# EAGLE design 90USB1286 (EAGLE 6.3)
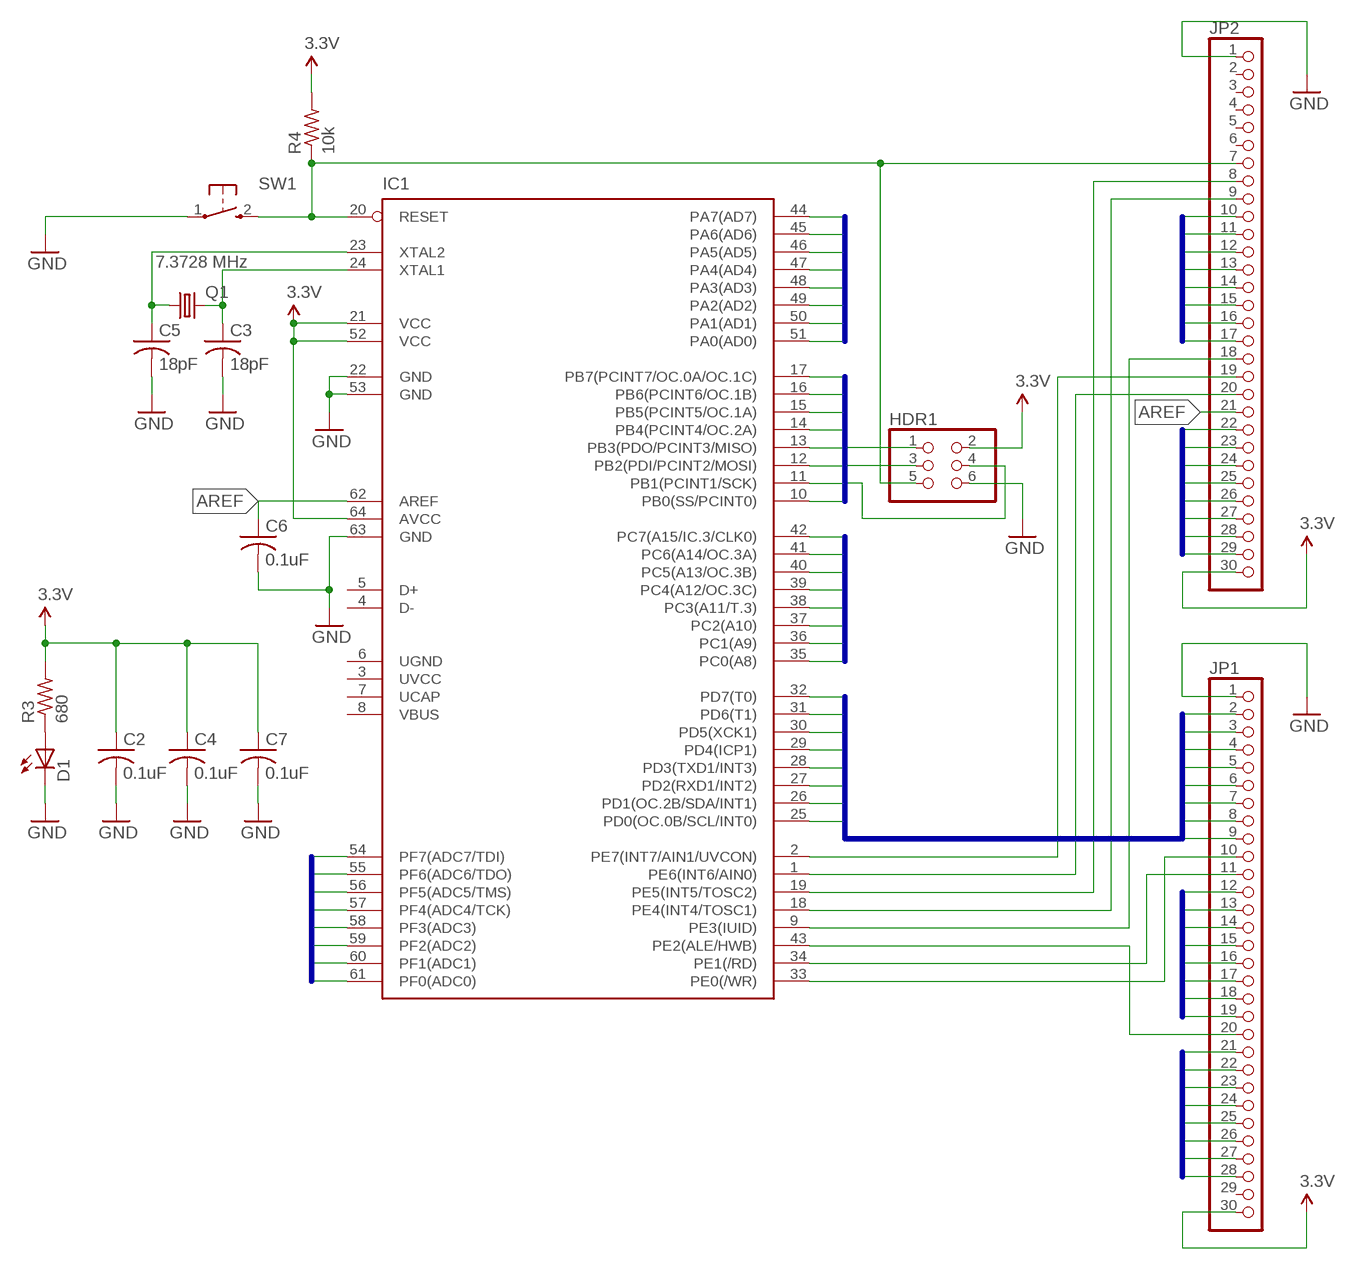
[diagram p0: schematic, sheet 1]

## Parts
C2  0.1uF  0603_CAP  [0603_RESISTOR]
C3  18pF  0603_CAP  [0603_RESISTOR]
C4  0.1uF  0603_CAP  [0603_RESISTOR]
C5  18pF  0603_CAP  [0603_RESISTOR]
C6  0.1uF  0603_CAP  [0603_RESISTOR]
C7  0.1uF  0603_CAP  [0603_RESISTOR]
D1  LEDCHIP-LED0603  [CHIP-LED0603]
HDR1  HEADER_2X3  [HEADER_2X3]
IC1  AT90USB1286MLF  [MLF64]
JP1  PINHD-1X30  [1X30]
JP2  PINHD-1X30  [1X30]
Q1  7.3728 MHz  CRYSTALCTS406  [CTS406]
R3  680  0603_RESISTOR  [0603_RESISTOR]
R4  10k  0603_RESISTOR  [0603_RESISTOR]
SW1  TAC-SWITCH  [TAC-SWITCH]

## Nets
3.3V: C2.1 C4.1 C7.1 HDR1.2 IC1.21(VCC) IC1.52(VCC) IC1.64(AVCC) JP1.30 JP2.30 R3.2 R4.2
A0: IC1.51(PA0(AD0)) JP1.28
A1: IC1.50(PA1(AD1)) JP1.27
A2: IC1.49(PA2(AD2)) JP1.26
A3: IC1.48(PA3(AD3)) JP1.25
A4: IC1.47(PA4(AD4)) JP1.24
A5: IC1.46(PA5(AD5)) JP1.23
A6: IC1.45(PA6(AD6)) JP1.22
A7: IC1.44(PA7(AD7)) JP1.21
AREF: C6.1 IC1.62(AREF) JP2.21
B0: IC1.10(PB0(SS/PCINT0)) JP2.17
B1: HDR1.3 IC1.11(PB1(PCINT1/SCK)) JP2.16
B2: HDR1.4 IC1.12(PB2(PDI/PCINT2/MOSI)) JP2.15
B3: HDR1.1 IC1.13(PB3(PDO/PCINT3/MISO)) JP2.14
B4: IC1.14(PB4(PCINT4/OC.2A)) JP2.13
B5: IC1.15(PB5(PCINT5/OC.1A)) JP2.12
B6: IC1.16(PB6(PCINT6/OC.1B)) JP2.11
B7: IC1.17(PB7(PCINT7/OC.0A/OC.1C)) JP2.10
C0: IC1.35(PC0(A8)) JP1.12
C1: IC1.36(PC1(A9)) JP1.13
C2: IC1.37(PC2(A10)) JP1.14
C3: IC1.38(PC3(A11/T.3)) JP1.15
C4: IC1.39(PC4(A12/OC.3C)) JP1.16
C5: IC1.40(PC5(A13/OC.3B)) JP1.17
C6: IC1.41(PC6(A14/OC.3A)) JP1.18
C7: IC1.42(PC7(A15/IC.3/CLK0)) JP1.19
D0: IC1.25(PD0(OC.0B/SCL/INT0)) JP1.2
D1: IC1.26(PD1(OC.2B/SDA/INT1)) JP1.3
D2: IC1.27(PD2(RXD1/INT2)) JP1.4
D3: IC1.28(PD3(TXD1/INT3)) JP1.5
D4: IC1.29(PD4(ICP1)) JP1.6
D5: IC1.30(PD5(XCK1)) JP1.7
D6: IC1.31(PD6(T1)) JP1.8
D7: IC1.32(PD7(T0)) JP1.9
E0: IC1.33(PE0(/WR)) JP1.10
E1: IC1.34(PE1(/RD)) JP1.11
E2: IC1.43(PE2(ALE/HWB)) JP1.20
E3: IC1.9(PE3(IUID)) JP2.18
E4: IC1.18(PE4(INT4/TOSC1)) JP2.9
E5: IC1.19(PE5(INT5/TOSC2)) JP2.8
E6: IC1.1(PE6(INT6/AIN0)) JP2.20
E7: IC1.2(PE7(INT7/AIN1/UVCON)) JP2.19
F0: IC1.61(PF0(ADC0)) JP2.22
F1: IC1.60(PF1(ADC1)) JP2.23
F2: IC1.59(PF2(ADC2)) JP2.24
F3: IC1.58(PF3(ADC3)) JP2.25
F4: IC1.57(PF4(ADC4/TCK)) JP2.26
F5: IC1.56(PF5(ADC5/TMS)) JP2.27
F6: IC1.55(PF6(ADC6/TDO)) JP2.28
F7: IC1.54(PF7(ADC7/TDI)) JP2.29
GND: C2.2 C3.2 C4.2 C5.2 C6.2 C7.2 D1.C HDR1.6 IC1.22(GND) IC1.53(GND) IC1.63(GND) JP1.1 JP2.1 SW1.1
N$1: C5.1 IC1.23(XTAL2) Q1.1
N$2: C3.1 IC1.24(XTAL1) Q1.3
N$3: D1.A R3.1
RESET: HDR1.5 IC1.20(RESET) JP2.7 R4.1 SW1.2
Unconnected: IC1.4(D-) IC1.5(D+) JP1.29 JP2.2 JP2.3 JP2.4 JP2.5 JP2.6

## Buses
D[0..7]
C[0..7]
A[0..7]
B[0..7]
F[0..7]

## Power pins joined to a net without a drawn wire
UCAP: IC1.7(UCAP)
UGND: IC1.6(UGND)
UVCC: IC1.3(UVCC)
VBUS: IC1.8(VBUS)

## Library data of the parts
C2-C7 = jkf-parts:0603_CAP: 0603 Capacitor
D1 = adafruit:LED: LED OSRAM: - CHIPLED LG R971, LG N971, LY N971, LG Q971, LY Q971, LO R971, LY R971 LH N974, LH R974 LS Q976, LO Q976, LY Q976 LO Q996 - Hyper CHIPLED LW Q18S LB Q993, LB Q99A, LB R99A - SideLED LS A670, LO A670, LY A670, LG A670, LP A670 LB A673, LV A673, LT A673, LW A673 LH A674 LY A675 LS A676, LA A676, LO A676, LY A676, LW A676 LS A679, LY A679, LG A679 - Hyper Micro SIDELED® LS Y876, LA Y876, LO Y876, LY Y876 LT Y87S - SmartLED LW L88C, LW L88S LB L89C, LB L89S, LG L890 LS L89K, LO L89K, LY L89K LS L896, LA L896, LO L896, LY L896 - TOPLED LS T670, LO T670, LY T670, LG T670, LP T670 LSG T670, LSP T670, LSY T670, LOP T670, LYG T670 LG T671, LOG T671, LSG T671 LB T673, LV T673, LT T673, LW T673 LH T674 LS T676, LA T676, LO T676, LY T676, LB T676, LH T676, LSB T676, LW T676 LB T67C, LV T67C, LT T67C, LS T67K, LO T67K, LY T67K, LW E67C LS E67B, LA E67B, LO E67B, LY E67B, LB E67C, LV E67C, LT E67C LW T67C LS T679, LY T679, LG T679 LS T770, LO T770, LY T770, LG T770, LP T770 LB T773, LV T773, LT T773, LW T773 LH T774 LS E675, LA E675, LY E675, LS T675 LS T776, LA T776, LO T776, LY T776, LB T776 LHGB T686 LT T68C, LB T68C - Hyper Mini TOPLED® LB M676 - Mini TOPLED Santana® LG M470 LS M47K, LO M47K, LY M47K Source: http://www.osram.convergy.de/
HDR1 = jkf:HEADER_2X3; DIGIKEY#: 609-3487-1-ND; MANF: FCI; MANF#: 95278-101A06LF
IC1 = jkf:AT90USB1286
JP1 JP2 = pinhead:PINHD-1X30: PIN HEADER
Q1 = crystal:CRYSTAL: CRYSTAL; OC_FARNELL: unknown; OC_NEWARK: unknown
R3 R4 = jkf-parts:0603_RESISTOR
SW1 = jkf-parts:TAC-SWITCH

## Board
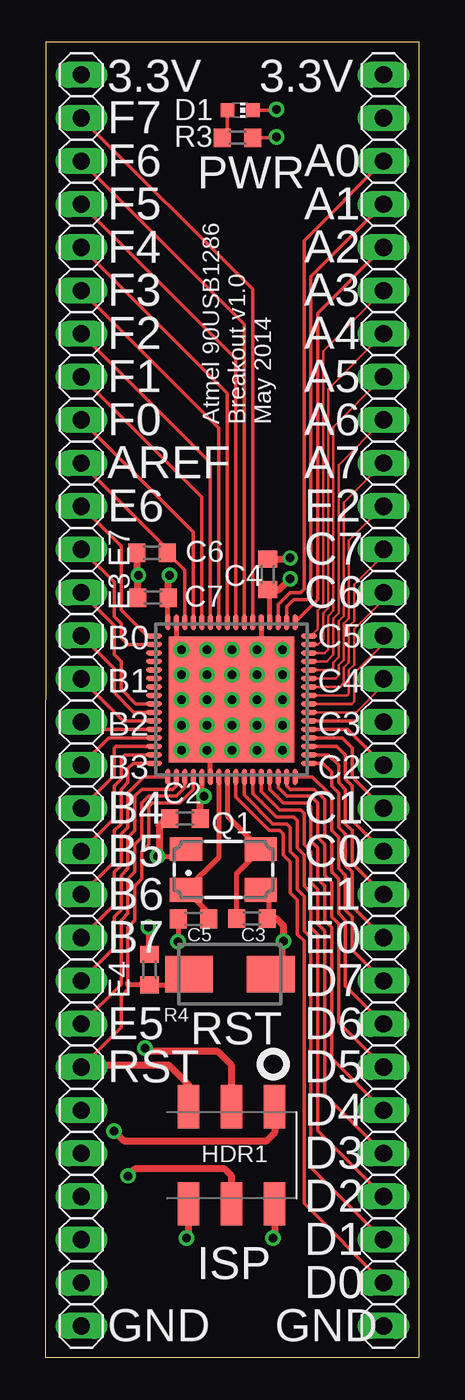
[diagram p1: board, top side]
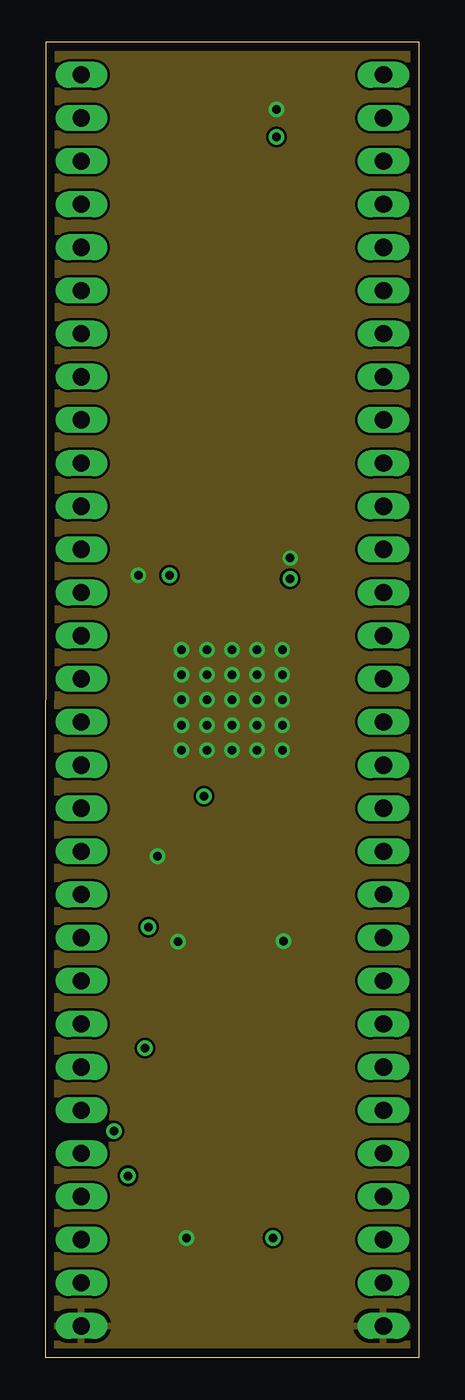
[diagram p2: board, inner layer GND]
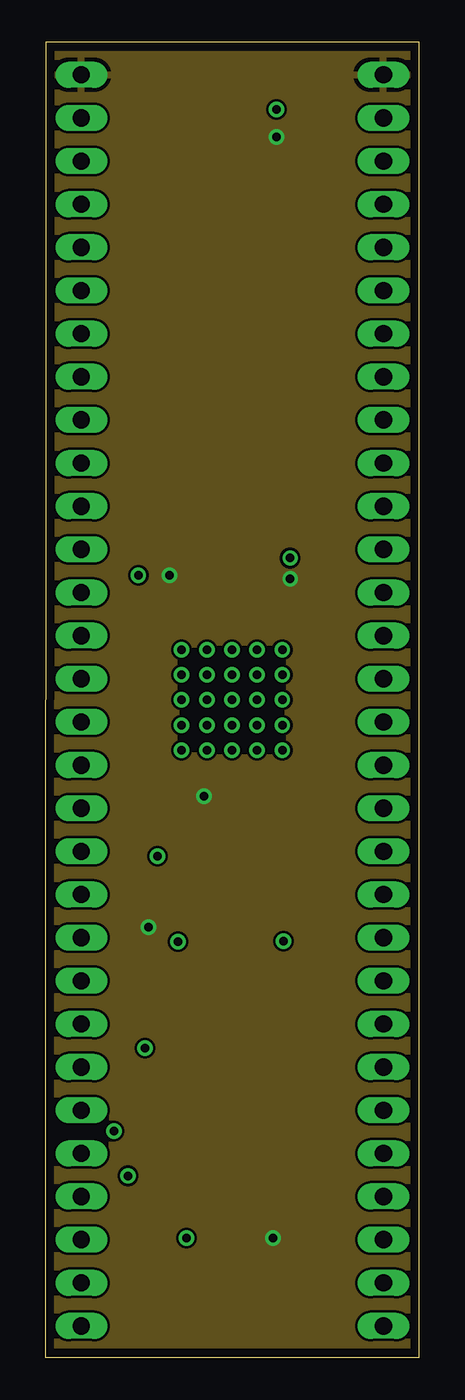
[diagram p3: board, inner layer 3.3V]
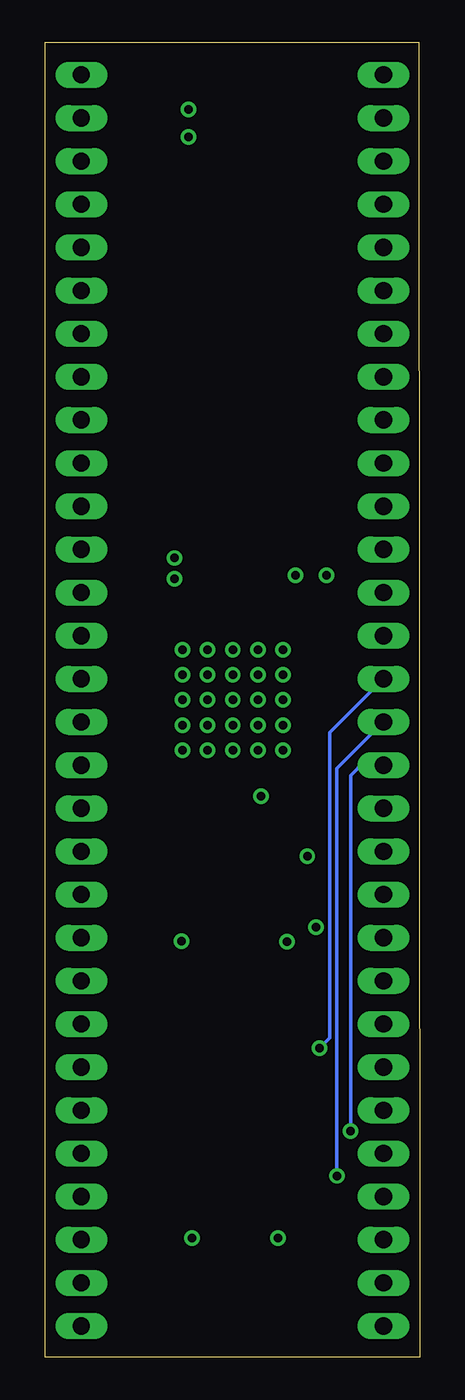
[diagram p4: board, bottom side, seen from below]

Size 22.03 x 77.39 mm. Coordinates in mm from the lower left corner, seen from the top.
Outline: 0,0 22.03,0 22.03,77.39 0.05,77.39 0,0
Copper layers (1+2*15+16): Top 0.0178mm / dielectric 12mil / GND 0.0356mm / dielectric 28mil / 3.3V 0.0356mm / dielectric 12mil / Bottom 0.0178mm
Design rules "SSC-EAGLE-4Lyr_v1.0.0.3": minimum track width 6mil, minimum drill 8mil, track to track 6mil, track to pad 6mil, pad to pad 6mil, via to via 6mil, smd to smd 6mil, copper to edge 20mil, drill to drill 16mil, minimum pad ring 8mil, minimum via ring 8mil, stop-mask expansion 3mil, vias tented up to drill 0mil, thermal gap 10mil

### Footprints (pad centres in the part's own frame; a part is rotated, then mirrored left to right if it is on the bottom)
0603_RESISTOR = smd 1 x 1.1: 1 -0.9,0; 2 0.9,0
CHIP-LED0603 = smd 0.8 x 0.8: A 0,-0.75; C 0,0.75
HEADER_2X3 = smd 1.27 x 2.54: 1 -2.54,-2.853; 2 -2.54,2.862; 3 0,-2.853; 4 0,2.862; 5 2.54,-2.853; 6 2.54,2.862
MLF64 = smd 0.95 x 0.3: 1 -4.56,3.75; 2 -4.56,3.25; 3 -4.56,2.75; 4 -4.56,2.25; 5 -4.56,1.75; 6 -4.56,1.25; 7 -4.56,0.75; 8 -4.56,0.25; 9 -4.56,-0.25; 10 -4.56,-0.75; 11 -4.56,-1.25; 12 -4.56,-1.75; 13 -4.56,-2.25; 14 -4.56,-2.75; 15 -4.56,-3.25; 16 -4.56,-3.75; 33 4.56,-3.75; 34 4.56,-3.25; 35 4.56,-2.75; 36 4.56,-2.25; 37 4.56,-1.75; 38 4.56,-1.25; 39 4.56,-0.75; 40 4.56,-0.25; 41 4.56,0.25; 42 4.56,0.75; 43 4.56,1.25; 44 4.56,1.75; 45 4.56,2.25; 46 4.56,2.75; 47 4.56,3.25; 48 4.56,3.75 | smd 0.3 x 0.95: 17 -3.75,-4.56; 18 -3.25,-4.56; 19 -2.75,-4.56; 20 -2.25,-4.56; 21 -1.75,-4.56; 22 -1.25,-4.56; 23 -0.75,-4.56; 24 -0.25,-4.56; 25 0.25,-4.56; 26 0.75,-4.56; 27 1.25,-4.56; 28 1.75,-4.56; 29 2.25,-4.56; 30 2.75,-4.56; 31 3.25,-4.56; 32 3.75,-4.56; 49 3.75,4.56; 50 3.25,4.56; 51 2.75,4.56; 52 2.25,4.56; 53 1.75,4.56; 54 1.25,4.56; 55 0.75,4.56; 56 0.25,4.56; 57 -0.25,4.56; 58 -0.75,4.56; 59 -1.25,4.56; 60 -1.75,4.56; 61 -2.25,4.56; 62 -2.75,4.56; 63 -3.25,4.56; 64 -3.75,4.56 | smd 7.4 x 7.4: P$1 0,0
1X30 = drill 1.016 long: 1 -36.83,0; 2 -34.29,0; 3 -31.75,0; 4 -29.21,0; 5 -26.67,0; 6 -24.13,0; 7 -21.59,0; 8 -19.05,0; 9 -16.51,0; 10 -13.97,0; 11 -11.43,0; 12 -8.89,0; 13 -6.35,0; 14 -3.81,0; 15 -1.27,0; 16 1.27,0; 17 3.81,0; 18 6.35,0; 19 8.89,0; 20 11.43,0; 21 13.97,0; 22 16.51,0; 23 19.05,0; 24 21.59,0; 25 24.13,0; 26 26.67,0; 27 29.21,0; 28 31.75,0; 29 34.29,0; 30 36.83,0
CTS406 = smd 1.9 x 1.4: 1 -2.2,-1.2; 2 2.2,-1.2; 3 2.2,1.2; 4 -2.2,1.2
TAC-SWITCH = smd 2.8 x 2.16: 1 1.4,1.08; 2 6.2,1.08

### Placement (x,y rotation side)
C2  8.23,31.7 180 top
C3  12.17,25.81 0 top
C4  13.11,46.08 90 top
C5  8.73,25.8 180 top
C6  6.3,47.35 180 top
C7  6.35,44.7 180 top
D1  11.48,73.41 270 top
HDR1  10.97,11.89 180 top
IC1  10.97,38.71 0 top
JP1  19.91,38.66 90 top
JP2  2.13,38.66 90 top
Q1  10.49,28.69 0 top
R3  11.33,71.78 0 top
R4  6.15,22.81 90 top
SW1  14.68,23.62 180 top

### Tracks (layer width: path | path; a pad name or v marks a point on that pad's centre or on a via)
3.3V  (via drill 0.5)
  Top 0.203: R3.2 13.56,71.78 v13.61,71.83
  Top 0.305: IC1.52 13.22,45.06 C4.1 | IC1.21 9.22,33.14 v9.35,33.02 | IC1.64 7.22,44.68 C7.1 | R4.2 6.1,23.71 v6.1,25.3
  Top 0.406: C7.1 7.25,45.96 v7.32,46.02 | C4.1 13.78,45.18 v14.43,45.82 | C2.1 9.13,32.8 v9.35,33.02 | HDR1.2 13.51,7.11 v13.41,7.01
  pour 3.3V: -0.41,77.77 23.27,77.77 23.27,-0.71 -0.41,-0.71
A0
  Top 0.203: IC1.51 13.72,44.3 14.43,45.01 15.04,45.01 15.24,45.21 15.24,65.73 JP1.28
A1
  Top 0.203: IC1.50 14.22,44.2 14.63,44.6 15.44,44.6 15.65,44.81 15.65,63.6 JP1.27
A2
  Top 0.203: IC1.49 16.05,44.6 16.05,61.47 JP1.26
A3
  Top 0.152: IC1.48 15.64,42.46 16.05,42.88 16.05,43.94 16.36,44.25 16.36,59.23 JP1.25
A4
  Top 0.152: IC1.47 16.05,41.96 16.36,42.27 16.36,43.79 16.66,44.09 16.66,57 JP1.24
A5
  Top 0.152: IC1.46 16.47,41.46 16.66,41.66 16.66,43.64 16.97,43.94 16.97,54.76 JP1.23
A6
  Top 0.152: IC1.45 16.58,40.96 16.97,41.35 16.97,43.48 17.27,43.79 17.27,52.53 JP1.22
A7
  Top 0.152: IC1.44 16.84,40.46 16.97,40.59 16.97,40.89 17.27,41.2 17.27,43.33 17.58,43.64 17.58,50.29 JP1.21
AREF
  Top 0.203: IC1.62 8.22,46.32 C6.1 7.2,47.56 JP2.21
B0
  Top 0.203: IC1.10 5.22,37.96 4.06,39.12 4.06,40.54 JP2.17
B1  (via drill 0.5)
  Top 0.203: IC1.11 4.6,37.46 JP2.16
  Top 0.406: HDR1.3 10.97,17.17 10.16,17.98 6.1,17.98 v5.89,18.19
  Bottom 0.203: v5.89,18.19 5.28,18.8 5.28,36.78 JP2.16
B2  (via drill 0.5)
  Top 0.203: IC1.12 2.56,36.96 JP2.15
  Top 0.406: HDR1.4 10.97,10.67 10.57,11.07 5.28,11.07 v4.88,10.67
  Bottom 0.203: JP2.15 4.88,34.65 v4.88,10.67
B3  (via drill 0.5)
  Top 0.203: IC1.13 3.74,36.46 JP2.14
  Top 0.406: HDR1.1 13.51,13.21 13.01,12.7 4.67,12.7 v4.06,13.31
  Bottom 0.203: JP2.14 2.34,35.05 3.25,35.05 4.06,34.24 v4.06,13.31
B4
  Top 0.203: IC1.14 4.16,35.96 4.06,35.87 4.06,34.24 JP2.13
B5
  Top 0.203: IC1.15 4.67,35.46 4.47,35.26 4.47,34.04 4.06,33.63 4.06,31.7 JP2.12
B6
  Top 0.203: IC1.16 5.19,34.96 4.88,34.65 4.88,33.83 4.47,33.43 4.47,31.39 4.06,30.99 4.06,29.16 JP2.11
B7
  Top 0.203: IC1.17 5.8,34.15 4.88,33.22 4.88,31.19 4.47,30.79 4.47,28.96 4.06,28.55 4.06,26.62 JP2.10
C0
  Top 0.203: IC1.35 17.18,35.96 17.68,35.46 17.68,34.04 18.09,33.63 18.09,31.6 JP1.12
C1
  Top 0.203: IC1.36 17.49,36.46 18.09,35.87 18.09,34.14 JP1.13
C2
  Top 0.203: IC1.37 17.8,36.96 JP1.14
C3
  Top 0.203: IC1.38 19.84,37.46 JP1.15
C4
  Top 0.152: IC1.39 18.3,37.96 19.71,39.37 19.71,39.73 JP1.16
C5
  Top 0.152: IC1.40 18.04,38.46 18.19,38.61 18.19,40.28 19.86,41.96 19.86,42.42 JP1.17
C6
  Top 0.152: IC1.41 17.78,38.96 17.88,39.06 17.88,40.44 18.19,40.74 18.19,42.88 19.86,44.55 19.86,44.96 JP1.18
C7
  Top 0.152: IC1.42 17.36,39.46 17.58,39.67 17.58,40.59 17.88,40.89 17.88,43.03 18.19,43.33 18.19,45.47 19.71,46.99 19.71,47.35 JP1.19
D0
  Top 0.203: IC1.25 11.22,32.97 13.21,30.99 13.82,30.99 14.02,30.79 14.02,29.57 14.43,29.16 14.43,27.33 14.83,26.92 14.83,24.89 15.24,24.49 15.24,9.04 JP1.2
D1
  Top 0.203: IC1.26 11.72,33.08 13.41,31.39 14.22,31.39 14.43,31.19 14.43,29.77 14.83,29.36 14.83,27.53 15.24,27.13 15.24,25.09 15.65,24.69 15.65,11.18 JP1.3
D2
  Top 0.203: IC1.27 12.22,33.19 13.61,31.8 14.63,31.8 14.83,31.6 14.83,29.97 15.24,29.57 15.24,27.74 15.65,27.33 15.65,25.3 16.05,24.89 16.05,13.31 JP1.4
D3
  Top 0.203: IC1.28 12.72,33.3 13.82,32.21 15.04,32.21 15.24,32 15.24,30.18 15.65,29.77 15.65,27.94 16.05,27.53 16.05,25.5 16.46,25.09 16.46,15.44 JP1.5
D4
  Top 0.203: IC1.29 13.22,33.41 14.02,32.61 15.44,32.61 15.65,32.41 15.65,30.38 16.05,29.97 16.05,28.14 16.46,27.74 16.46,25.7 16.87,25.3 16.87,17.58 JP1.6
D5
  Top 0.203: IC1.30 13.72,33.52 14.22,33.02 15.65,33.02 16.05,32.61 16.05,30.58 16.46,30.18 16.46,28.35 16.87,27.94 16.87,25.91 17.27,25.5 17.27,19.71 JP1.7
D6
  Top 0.203: IC1.31 14.22,33.63 14.43,33.43 15.85,33.43 16.46,32.82 16.46,30.79 16.87,30.38 16.87,28.55 17.27,28.14 17.27,26.11 17.68,25.7 17.68,21.84 JP1.8
D7
  Top 0.203: IC1.32 15.74,34.15 16.87,33.02 16.87,30.99 17.27,30.58 17.27,28.75 17.68,28.35 17.68,26.31 18.09,25.91 18.09,23.98 JP1.9
E0
  Top 0.203: IC1.33 16.35,34.96 16.87,34.44 16.87,33.63 17.27,33.22 17.27,31.19 17.68,30.79 17.68,28.96 18.09,28.55 18.09,26.52 JP1.10
E1
  Top 0.203: IC1.34 16.66,35.46 17.27,34.85 17.27,33.83 17.68,33.43 17.68,31.39 18.09,30.99 18.09,29.06 JP1.11
E2
  Top 0.152: IC1.43 17.1,39.96 17.27,40.13 17.27,40.74 17.58,41.05 17.58,43.18 17.88,43.48 17.88,48.06 JP1.20
E3
  Top 0.203: IC1.9 5.33,38.46 4.47,39.32 4.47,40.95 4.06,41.35 4.06,43.08 JP2.18
E4
  Top 0.203: IC1.18 7.72,33.63 7.52,33.43 5.69,33.43 5.28,33.02 5.28,30.99 4.88,30.58 4.88,28.75 4.47,28.35 4.47,26.31 4.06,25.91 4.06,24.08 JP2.9
E5
  Top 0.203: IC1.19 8.22,33.52 7.72,33.02 6.1,33.02 5.69,32.61 5.69,30.58 5.28,30.18 5.28,28.55 4.88,28.14 4.88,26.11 4.47,25.7 4.47,21.95 JP2.8
E6
  Top 0.203: IC1.1 6,42.46 4.47,43.99 4.47,47.75 JP2.20
E7
  Top 0.203: IC1.2 4.88,41.96 4.47,42.37 4.47,43.18 4.06,43.59 4.06,45.62 JP2.19
F0
  Top 0.203: IC1.61 8.72,48.58 JP2.22
F1
  Top 0.203: IC1.60 9.22,50.62 JP2.23
F2
  Top 0.203: IC1.59 9.72,52.66 JP2.24
F3
  Top 0.203: IC1.58 10.22,54.7 JP2.25
F4
  Top 0.203: IC1.57 10.72,56.74 JP2.26
F5
  Top 0.203: IC1.56 11.22,58.78 JP2.27
F6
  Top 0.203: IC1.55 11.72,60.82 JP2.28
F7
  Top 0.203: IC1.54 12.22,62.86 JP2.29
GND  (via drill 0.5)
  Top 0.203: D1.C 13.56,73.41 v13.61,73.46
  Top 0.305: 14.38,47.09 v14.43,47.04 | SW1.1 14.02,22.54 v14.02,24.49 | C5.2 7.83,24.46 v7.82,24.45 | IC1.63 7.72,41.96 v8.04,41.65 | IC1.53 12.72,41.89 v12.48,41.65 | IC1.22 9.72,35.52 v9.52,35.73
  Top 0.406: C7.2 5.45,45.99 v5.49,46.02 5.4,46.11 C6.2 | C4.2 14.36,46.98 v14.43,47.04 | HDR1.6 8.43,7.11 v8.33,7.01 | C2.2 7.11,31.7 6.71,31.29 6.71,29.57 v6.62,29.48 | C3.2 13.61,25.81 14.02,25.4 v14.02,24.49
  other vias: 8.04,35.73 11,35.73 12.48,35.73 13.96,35.73 13.96,37.21 12.48,37.21 11,37.21 9.52,37.21 8.04,37.21 8.04,38.69 9.52,38.69 11,38.69 12.48,38.69 13.96,38.69 13.96,40.17 12.48,40.17 11,40.17 9.52,40.17 8.04,40.17 9.52,41.65 11,41.65 13.96,41.65
  pour GND: -0.41,77.77 23.27,77.77 23.27,-0.71 -0.41,-0.71
N$1
  Top 0.305: IC1.23 10.22,29.42 Q1.1 9.63,26.16 C5.1
N$2
  Top 0.305: IC1.24 10.72,31.86 Q1.3 11.28,28.48 C3.1
N$3
  Top 0.203: D1.A 10.73,72.08 R3.1
N$4
  Top 0.305: 6.5,29.46 7.92,29.46 8.33,29.87
N$5
  Top 0.305: 13.21,25.81 13.21,27.03 12.6,27.64
RESET
  Top 0.203: IC1.20 8.72,33.41 7.92,32.61 6.3,32.61 6.1,32.41 6.1,30.18 5.69,29.77 5.69,28.14 5.28,27.74 5.28,25.7 4.88,25.3 4.88,22.05 4.88,21.64 4.47,21.23 4.47,19.41 2.54,17.48 JP2.7
  Top 0.305: 4.88,22.05 4.88,21.91 R4.1 8.48,21.91 SW1.2 | 2.85,17.17 2.54,17.48
  Top 0.406: HDR1.5 8.43,16.05 7.32,17.17 2.23,17.17 JP2.7

### Text on the board
tDocu: C
tSilk: 3.3V | 3.3V | F7 | F6 | PWR | A0 | F5 | A1 | F4 | A2 | F3 | A3 | F2 | A4 | F1 | A5 | Atmel 90USB1286 | Breakout v1.0 | May 2014 | F0 | A6 | AREF | A7 | E6 | E2 | E7 | C7 | E3 | C6 | B0 | C5 | B1 | C4 | B2 | C3 | B3 | C2 | B4 | C1 | B5 | C0 | B6 | E1 | B7 | E0 | E4 | D7 | E5 | D6 | RST | RST | D5 | D4 | D3 | D2 | D1 | ISP | D0 | GND | GND